# EAGLE design quantik (EAGLE 7.4.0)
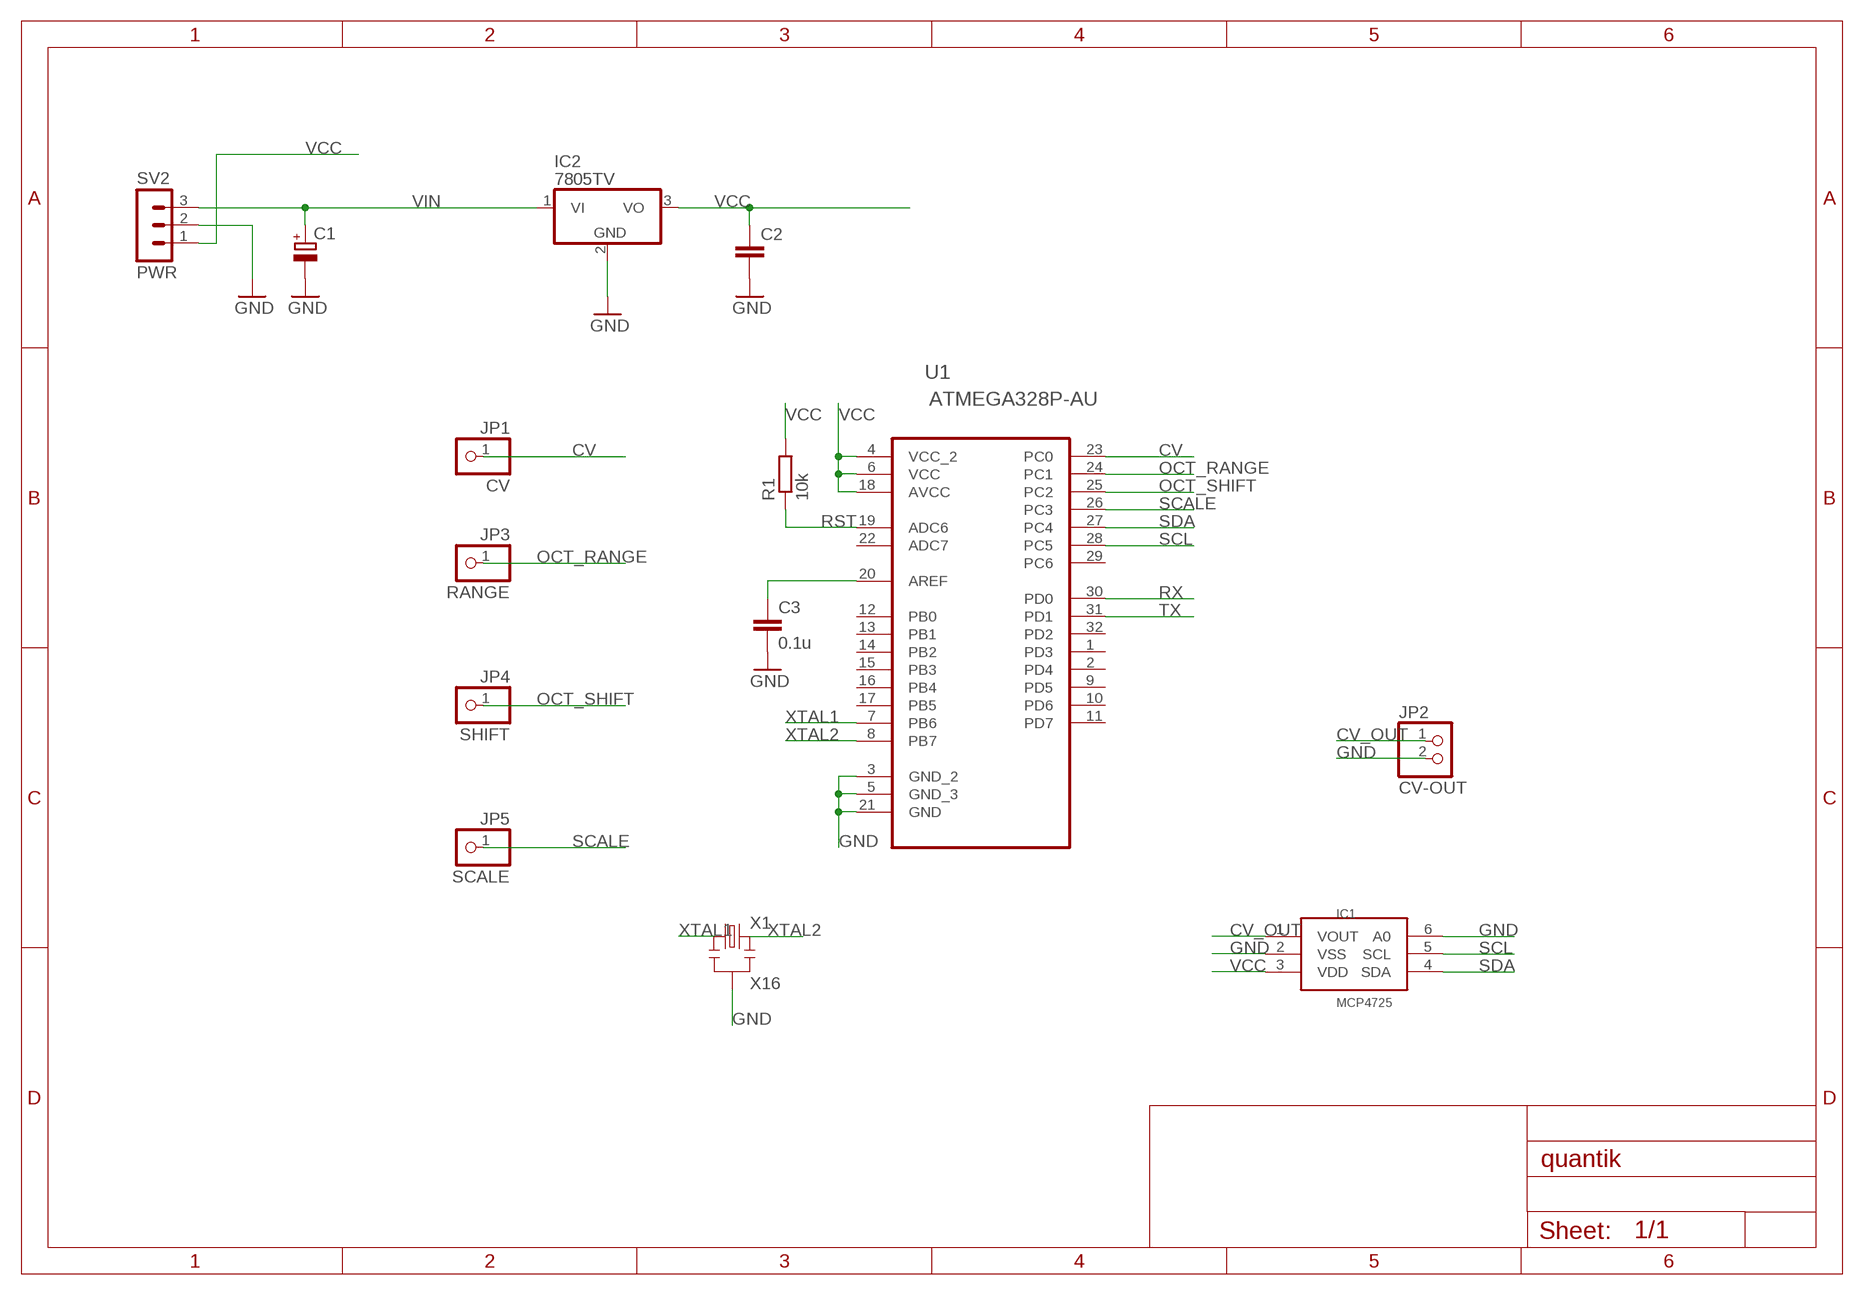
[diagram p0: schematic, sheet 1]

## Parts
C1  CPOL-EUE5-10.5  [E5-10,5]
C2  C-EU050-030X075  [C050-030X075]
C3  0.1u  C-EUC0805  [C0805]
IC1  MCP4725  [SOT23-6]
IC2  7805TV  [TO220V]
JP1  CV  PINHD-1X1  [1X01]
JP2  CV-OUT  PINHD-1X2  [1X02]
JP3  RANGE  PINHD-1X1  [1X01]
JP4  SHIFT  PINHD-1X1  [1X01]
JP5  SCALE  PINHD-1X1  [1X01]
R1  10k  R-EU_R0805  [R0805]
SV2  PWR  MA03-1  [MA03-1]
U1  ATMEGA328P-AU  [QFP80P900X900X120-32N]
X1  X16  RESONATOR_16MHZ  [RESONATOR_SMD]

## Nets
CV: JP1.1 U1.23(PC0)
CV_OUT: IC1.1(VOUT) JP2.1
GND: C1.- C2.2 C3.2 IC1.2(VSS) IC1.6(A0) IC2.2(GND) JP2.2 SV2.2 U1.3(GND_2) U1.5(GND_3) U1.21(GND) X1.2
N$1: C3.1 U1.20(AREF)
OCT_RANGE: JP3.1 U1.24(PC1)
OCT_SHIFT: JP4.1 U1.25(PC2)
RST: R1.1 U1.19(ADC6)
RX: U1.30(PD0)
SCALE: JP5.1 U1.26(PC3)
SCL: IC1.5(SCL) U1.28(PC5)
SDA: IC1.4(SDA) U1.27(PC4)
TX: U1.31(PD1)
VCC: C2.1 IC1.3(VDD) IC2.3(VO) R1.2 SV2.1 U1.4(VCC_2) U1.6(VCC) U1.18(AVCC)
VIN: C1.+ IC2.1(VI) SV2.3
XTAL1: U1.7(PB6) X1.1
XTAL2: U1.8(PB7) X1.3
Unconnected: U1.1(PD3) U1.2(PD4) U1.9(PD5) U1.10(PD6) U1.11(PD7) U1.12(PB0) U1.13(PB1) U1.14(PB2) U1.15(PB3) U1.16(PB4) U1.17(PB5) U1.22(ADC7) U1.29(PC6) U1.32(PD2)

## Library data of the parts
C1 = rcl:CPOL-EU: POLARIZED CAPACITOR, European symbol
C2 C3 = rcl:C-EU: CAPACITOR, European symbol
IC1 = microchip-update:MCP4725: 12-Bit Digital-to-Analog Converter with EEPROM Memory in SOT-23-6
IC2 = linear:78*: Positive VOLTAGE REGULATOR Source: http://cache.national.com/ds/LM/LM78L05.pdf http://www.fairchildsemi.com/ds/LM/LM7805.pdf
JP1 JP3-JP5 = pinhead:PINHD-1X1: PIN HEADER
JP2 = pinhead:PINHD-1X2: PIN HEADER
R1 = rcl:R-EU_: RESISTOR, European symbol
SV2 = con-lstb:MA03-1: PIN HEADER; OC_FARNELL: unknown; OC_NEWARK: unknown
U1 = Atmega328pAU:ATMEGA328P-AU; DESCRIPTION: 8-bit Microcontroller with In-System Programmable Flash; MPN: ATMEGA328P-AU; OC_FARNELL: 1715486; OC_NEWARK: 14R4631; PACKAGE: TQFP-32; SUPPLIER: Atmel
X1 = kanflo:RESONATOR_16MHZ

## Board
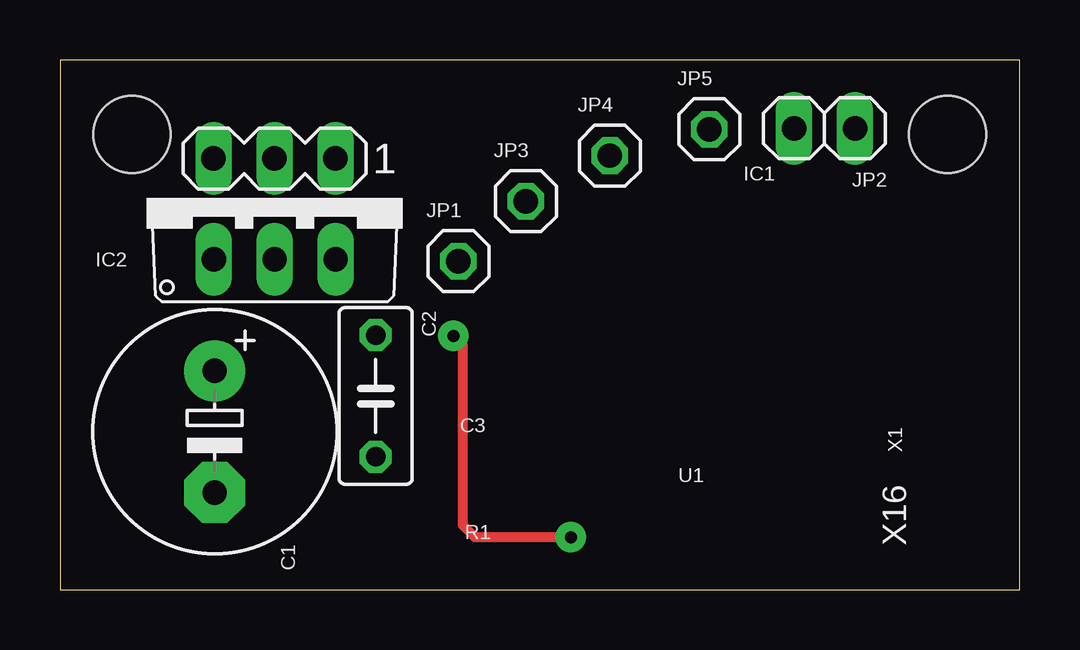
[diagram p1: board, top side]
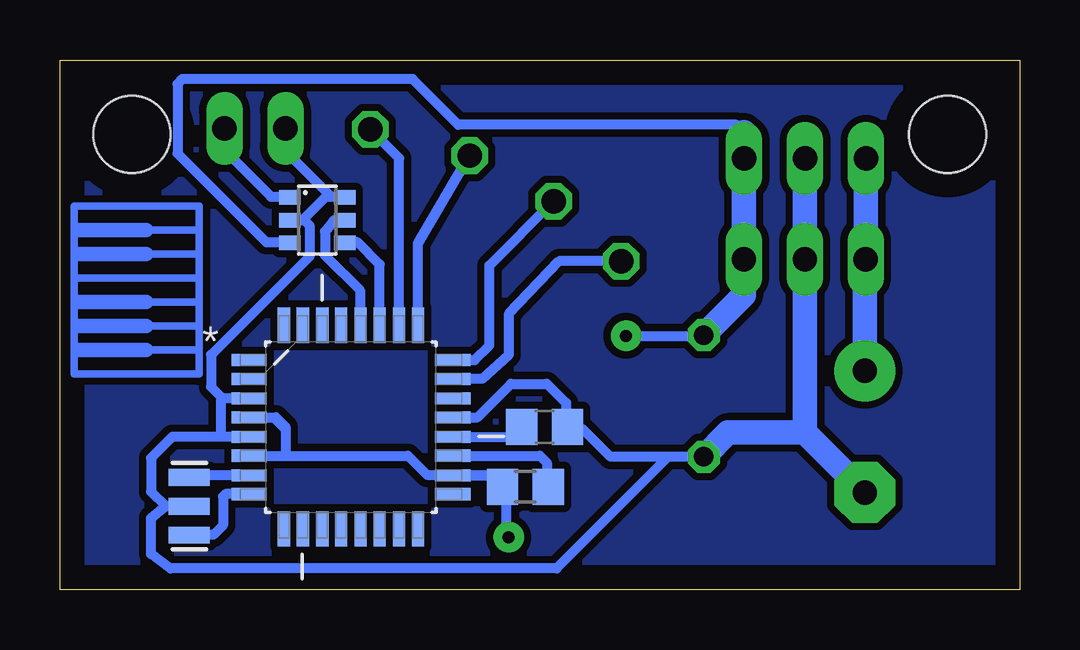
[diagram p2: board, bottom side, seen from below]

Size 40 x 22.1 mm. Coordinates in mm from the lower left corner, seen from the top.
Outline: 0,0 40,0 40,22.1 0,22.1 0,0
Copper layers (1*16): Top 0.035mm / dielectric 1.5mm / Bottom 0.035mm
Design rules "default": minimum track width 10mil, minimum drill 24mil, track to track 8mil, track to pad 8mil, pad to pad 8mil, via to via 8mil, smd to smd 8mil, copper to edge 40mil, drill to drill 8mil, minimum pad ring 10mil, minimum via ring 8mil, stop-mask expansion 4mil, vias tented up to drill 0mil, thermal gap 10mil
Holes 3.2 mm at 3,19 37,19

### Footprints (pad centres in the part's own frame; a part is rotated, then mirrored left to right if it is on the bottom)
E5-10,5 = drill 1.016 pad 2.54: + -2.54,0 | drill 1.016 pad 2.54 octagon: - 2.54,0
C050-030X075 = drill 0.813 octagon: 1 -2.54,0; 2 2.54,0
C0805 = smd 1.3 x 1.5: 1 -0.95,0; 2 0.95,0
SOT23-6 = smd 0.6 x 0.9: 1 -0.95,-1.15; 2 0,-1.15; 3 0.95,-1.15; 4 0.95,1.15; 5 0,1.15; 6 -0.95,1.15
TO220V = drill 1.016 long: 1 -2.54,-2.54; 2 0,-2.54; 3 2.54,-2.54
1X01 = drill 1.016 octagon: 1 0,0
1X02 = drill 1.016 long: 1 -1.27,0; 2 1.27,0
R0805 = smd 1.3 x 1.5: 1 -0.95,0; 2 0.95,0
MA03-1 = drill 1.016 long: 1 -2.54,0; 2 0,0; 3 2.54,0
QFP80P900X900X120-32N = smd 1.473 x 0.508: 1 -4.242,2.794; 2 -4.242,2.007; 3 -4.242,1.194; 4 -4.242,0.406; 5 -4.242,-0.406; 6 -4.242,-1.194; 7 -4.242,-2.007; 8 -4.242,-2.794; 17 4.242,-2.794; 18 4.242,-2.007; 19 4.242,-1.194; 20 4.242,-0.406; 21 4.242,0.406; 22 4.242,1.194; 23 4.242,2.007; 24 4.242,2.794 | smd 0.508 x 1.473: 9 -2.794,-4.242; 10 -2.007,-4.242; 11 -1.194,-4.242; 12 -0.406,-4.242; 13 0.406,-4.242; 14 1.194,-4.242; 15 2.007,-4.242; 16 2.794,-4.242; 25 2.794,4.242; 26 2.007,4.242; 27 1.194,4.242; 28 0.406,4.242; 29 -0.406,4.242; 30 -1.194,4.242; 31 -2.007,4.242; 32 -2.794,4.242
RESONATOR_SMD = smd 0.7 x 1.7: 1 0.4,0.8; 2 1.6,0.8; 3 2.8,0.8

### Placement (x,y rotation side)
C1  6.45,6.6 270 top
C2  13.16,8.09 270 top
C3  19.8,6.8 0 bottom
IC1  29.27,15.42 270 bottom
IC2  8.95,16.33 0 top
JP1  16.61,13.71 0 top
JP2  31.87,19.25 180 top
JP3  19.42,16.21 0 top
JP4  22.92,18.11 0 top
JP5  27.07,19.21 0 top
R1  20.6,4.3 180 bottom
SV2  8.94,17.99 180 top
U1  27.87,6.79 0 bottom
X1  35.41,5.09 270 bottom

### Tracks (layer width: path | path; a pad name or v marks a point on that pad's centre or on a via)
CV
  Bottom 0.406: JP1.1 19.19,13.71 21.3,11.5 21.3,9.8 22.4,8.8 U1.23
CV_OUT
  Bottom 0.406: JP2.1 33.14,18.34 31.2,16.4 30.45,16.4 IC1.1
GND
  Bottom 0.406: U1.3 33.22,7.98 | 33.22,7.98 33.3,7.9 33.3,6.5 33.2,6.4 32.13,6.4 U1.5 35.32,6.38 36.2,5.5 36.2,4.1 35.6,3.5 | 35.6,3.5 X1.2 | C2.2 14.65,5.55 | 14.65,5.55 19.3,0.9 35.4,0.9 36.2,1.5 36.2,3 35.6,3.5 | 28.7,16.4 28.9,16.4 29.88,15.42 IC1.2 29.82,15.42 29.6,15.2 29.6,13.9 33.7,9.8 33.7,8.47 33.22,7.98 | 28.7,16.4 28.15,16.4 IC1.6 | 14.65,5.55 17.05,5.55 18.2,6.7 18.95,6.7 C3.2 18.9,6.85 18.9,7.8 19.7,8.6 21.2,8.6 22.6,7.2 U1.21 | JP2.2 30.6,18.3 28.7,16.4
  Bottom 1.016: IC2.2 8.95,13.2 | 8.95,13.2 8.95,6.56 | 8.95,6.56 C1.- | 8.95,6.56 12.15,6.56 C2.2 | SV2.2 8.94,13.21 8.95,13.2
N$1
  Bottom 0.406: U1.20 21.07,6.38 C3.1
N$2
  Bottom 0.305: 39.4,15 39.4,16 34.2,16 34.2,11 | 39.4,15 39.2,15 | 36.4,15 34.2,15 34.2,14 36.4,14 | 39.2,14 39.4,14 39.4,13 34.2,13 34.2,12 36.4,12 | 39.2,12 39.4,12 39.4,11 39.2,11 | 36.4,11 34.2,11 | 34.2,11 34.2,10 | 39.4,10 39.4,15 | 34.2,10 36.4,10 | 39.2,10 39.4,10 | 34.2,10 34.2,9 39.4,9 39.4,10
  Bottom 0.61: 39.2,15 36.4,15 | 36.4,14 39.2,14 | 36.4,12 39.2,12 | 36.4,11 39.2,11 | 36.4,10 39.2,10
N$3
  pour Bottom (isolate 0.305): 0,22 40,22 40,0 0,0
OCT_RANGE
  Bottom 0.406: U1.24 22.72,9.58 22.1,10.2 22.1,13.53 JP3.1
OCT_SHIFT
  Bottom 0.406: U1.25 25.08,14.45 JP4.1
RST
  Bottom 0.406: U1.19 20,5.6 19.7,5.3 19.7,4.35 R1.1
SCALE
  Bottom 0.406: U1.26 25.86,18 JP5.1
SCL
  Bottom 0.406: IC1.5 28.58,15.42 28.95,14.95 28.95,13.95 27.5,12.5 27.5,11.07 U1.28
SDA
  Bottom 0.406: U1.27 26.68,13.58 27.6,14.5 28.09,14.5 IC1.4
VCC  (via drill 0.5 pad 1.27)
  Top 0.406: v21.3,2.2 17.3,2.2 16.8,2.7 16.8,10.2 v16.4,10.6
  Bottom 0.406: U1.6 30.5,5.6 | 30.5,5.6 25.5,5.6 | 25.5,5.6 24.7,4.8 23.64,4.8 | 23.64,4.8 U1.18 21.53,4.78 R1.2 | U1.4 31,7.2 | 31,7.2 30.6,6.8 30.6,6.7 | 30.6,6.7 30.6,5.7 | 30.6,5.7 30.5,5.6 | IC1.3 30.45,14.5 31.4,14.5 35.1,18.2 35.1,21.1 34.9,21.3 25.3,21.3 23.4,19.4 11.8,19.4 11.6,19.2 11.6,12.2 C2.1 13.19,10.6 v16.4,10.6 | 31,7.2 31,7.1 30.6,6.7 | 30.6,5.7 30.6,5.6 25.5,5.6 | 23.64,4.8 22,4.8 21.9,4.7 21.9,4.4 21.4,3.9 21.4,2.3 v21.3,2.2
  Bottom 1.016: C2.1 11.49,12.3 IC2.3 11.49,19.08 SV2.1
VIN
  Bottom 1.016: SV2.3 IC2.1 6.45,13.75 C1.+
XTAL1
  Bottom 0.406: U1.7 34.52,4.78 X1.1
XTAL2
  Bottom 0.406: U1.8 33.1,4 33.2,3.9 33.2,2.7 33.6,2.3 X1.3